# EAGLE design Keyboard_Scanner_2pp_RevA (EAGLE 9.6.2)
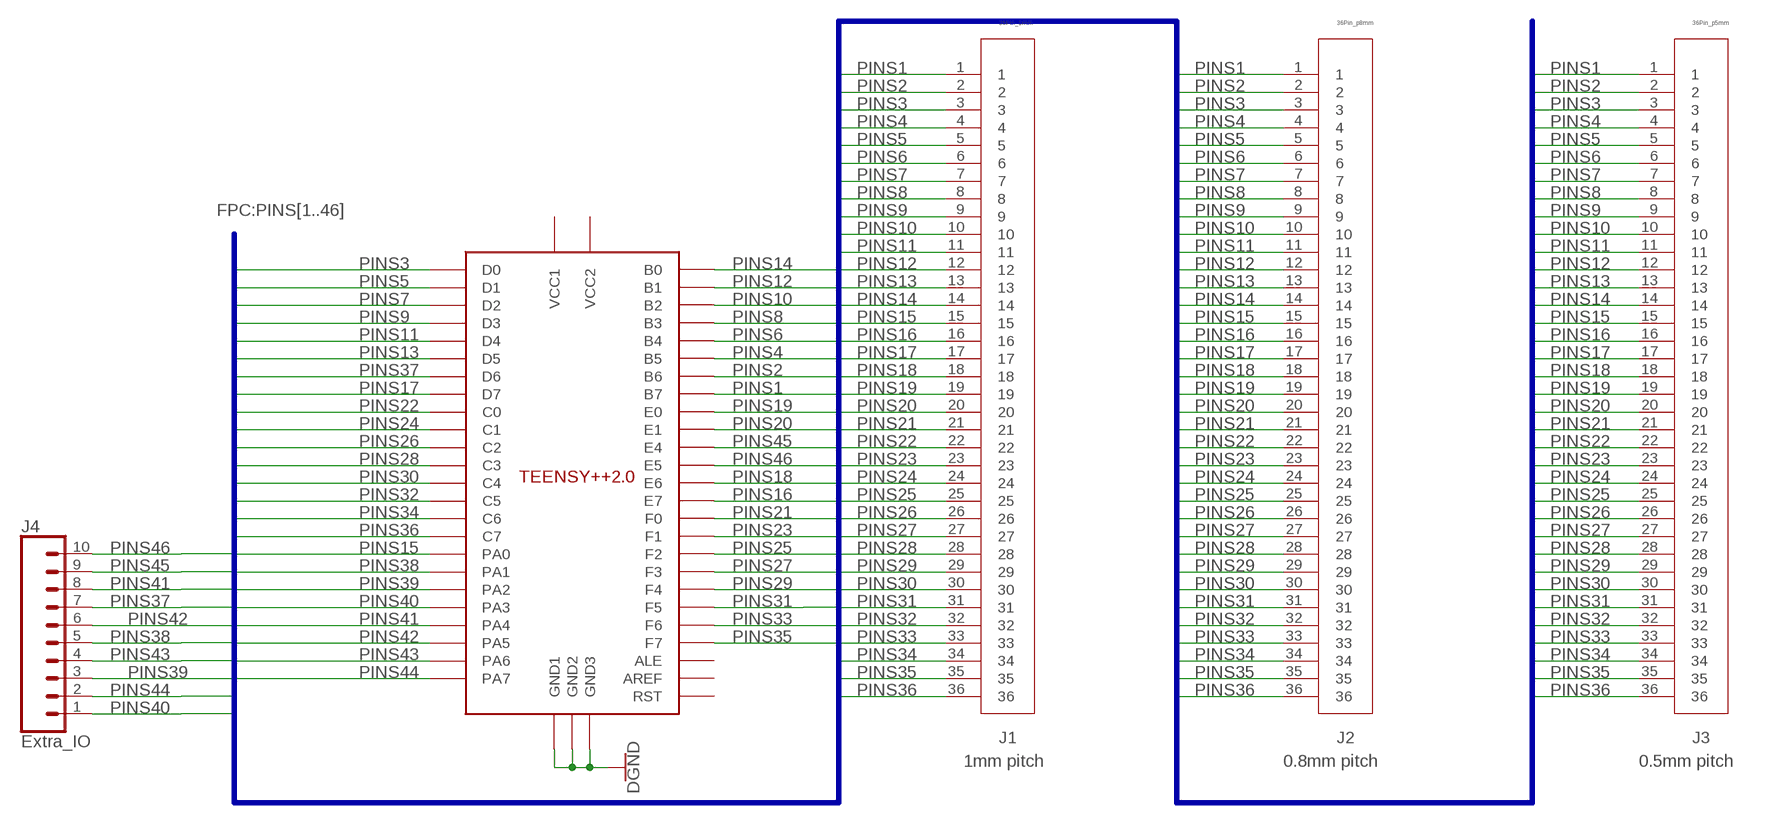
[diagram p0: schematic, sheet 1]

## Parts
J1  36Pin_1mm  FPC36_1MM  [FPC36_1MM]
J2  36Pin_p8mm  FPC36_P8MM  [FPC36_P8MM]
J3  36Pin_p5mm  FPC36_P5MM  [FPC36_P5MM]
J4  Extra_IO  CONN_10"  [1X10]
U$1  Teensy++2.0  TEENSYPP2.0  [TEENSYPP2.0]

## Nets
GND: U$1.GND1 U$1.GND2 U$1.GND3 ; supply symbol labelled DGND
PINS1: J1.1 J2.1 J3.1 U$1.B7
PINS2: J1.2 J2.2 J3.2 U$1.B6
PINS3: J1.3 J2.3 J3.3 U$1.D0
PINS4: J1.4 J2.4 J3.4 U$1.B5
PINS5: J1.5 J2.5 J3.5 U$1.D1
PINS6: J1.6 J2.6 J3.6 U$1.B4
PINS7: J1.7 J2.7 J3.7 U$1.D2
PINS8: J1.8 J2.8 J3.8 U$1.B3
PINS9: J1.9 J2.9 J3.9 U$1.D3
PINS10: J1.10 J2.10 J3.10 U$1.B2
PINS11: J1.11 J2.11 J3.11 U$1.D4
PINS12: J1.12 J2.12 J3.12 U$1.B1
PINS13: J1.13 J2.13 J3.13 U$1.D5
PINS14: J1.14 J2.14 J3.14 U$1.B0
PINS15: J1.15 J2.15 J3.15 U$1.PA0
PINS16: J1.16 J2.16 J3.16 U$1.E7
PINS17: J1.17 J2.17 J3.17 U$1.D7
PINS18: J1.18 J2.18 J3.18 U$1.E6
PINS19: J1.19 J2.19 J3.19 U$1.E0
PINS20: J1.20 J2.20 J3.20 U$1.E1
PINS21: J1.21 J2.21 J3.21 U$1.F0
PINS22: J1.22 J2.22 J3.22 U$1.C0
PINS23: J1.23 J2.23 J3.23 U$1.F1
PINS24: J1.24 J2.24 J3.24 U$1.C1
PINS25: J1.25 J2.25 J3.25 U$1.F2
PINS26: J1.26 J2.26 J3.26 U$1.C2
PINS27: J1.27 J2.27 J3.27 U$1.F3
PINS28: J1.28 J2.28 J3.28 U$1.C3
PINS29: J1.29 J2.29 J3.29 U$1.F4
PINS30: J1.30 J2.30 J3.30 U$1.C4
PINS31: J1.31 J2.31 J3.31 U$1.F5
PINS32: J1.32 J2.32 J3.32 U$1.C5
PINS33: J1.33 J2.33 J3.33 U$1.F6
PINS34: J1.34 J2.34 J3.34 U$1.C6
PINS35: J1.35 J2.35 J3.35 U$1.F7
PINS36: J1.36 J2.36 J3.36 U$1.C7
PINS37: J4.7 U$1.D6
PINS38: J4.5 U$1.PA1
PINS39: J4.3 U$1.PA2
PINS40: J4.1 U$1.PA3
PINS41: J4.8 U$1.PA4
PINS42: J4.6 U$1.PA5
PINS43: J4.4 U$1.PA6
PINS44: J4.2 U$1.PA7
PINS45: J4.9 U$1.E4
PINS46: J4.10 U$1.E5
Unconnected: U$1.ALE U$1.AREF U$1.RST U$1.VCC1 U$1.VCC2

## Buses
FPC:PINS[1..46]

## Notes on the sheet
- 1mm pitch | 0.8mm pitch | 0.5mm pitch

## Library data of the parts
J1 = FPC36_1mm:FPC36_1MM: Molex Right Angle FPC Connector 1mm pitch, bottom contacts with 32 pins. Molex Part Number DigiKey Part Number
J2 = FPC36_p8mm:FPC36_P8MM: Molex Right Angle FPC Connector 1mm pitch, bottom contacts with 32 pins. Molex Part Number DigiKey Part Number
J3 = FPC36_p5mm:FPC36_P5MM: Molex Right Angle FPC Connector 1mm pitch, bottom contacts with 32 pins. Molex Part Number DigiKey Part Number
J4 = SparkFun-Connectors:CONN_10: Multi connection point. Often used as Generic Header-pin footprint for 0.1 inch spaced/style header connections On any of the 0.1 inch spaced packages, you can populate with these: Break Away Headers - Straight <https://www.sparkfun.com/products/116> (PRT-00116) Break Away Male Headers - Right Angle <https://www.sparkfun.com/products/553> (PRT-00553) Female Headers <https://www.sparkfun.com/products/115> (PRT-00115) Break Away Headers - Machine Pin <https://www.sparkfun.com/products/117> (PRT-00117) Break Away Female Headers - Swiss Machine Pin <https://www.sparkfun.com/products/743> (PRT-00743) Arduino Stackable Header - 10 Pin <https://www.sparkfun.com/products/11376> (PRT-11376) For SCREWTERMINALS and SPRING TERMINALS visit here: Screw Terimnals on SparkFun.com <https://www.sparkfun.com/search/results?term=Screw+Terminals> (5mm/3.5mm/2.54mm spacing) This device is also useful as a general connection point to wire up your design to another part of your project. Our various solder wires solder well into these plated through hole pads. Hook-Up Wire - Assortment (Stranded, 22 AWG) <https://www.sparkfun.com/products/11375> (PRT-11375) Hook-Up Wire - Assortment (Solid Core, 22 AWG) <https://www.sparkfun.com/products/11367> (PRT-11367) View the entire wire category on our website here <https://www.sparkfun.com/categories/141> Special notes: Molex polarized connector foot print use with SKU : PRT-08231 with associated crimp pins and housings. 1MM SMD Version SKU: PRT-10208 NOTES ON THE VARIANTS LOCK and LOCK_LONGPADS... This footprint was designed to help hold the alignment of a through-hole component (i.e. 6-pin header) while soldering it into place. You may notice that each hole has been shifted either up or down by 0.005 of an inch from it's more standard position (which is a perfectly straight line). This slight alteration caused the pins (the squares in the middle) to touch the edges of the holes. Because they are alternating, it causes a "brace" to hold the component in place. 0.005 has proven to be the perfect amount of "off-center" position when using our standard breakaway headers. Although looks a little odd when you look at the bare footprint, once you have a header in there, the alteration is very hard to notice. Also,if you push a header all the way into place, it is covered up entirely on the bottom side.; PROD_ID: CONN-11563
U$1 = Teensy:TEENSYPP2.0

## Board
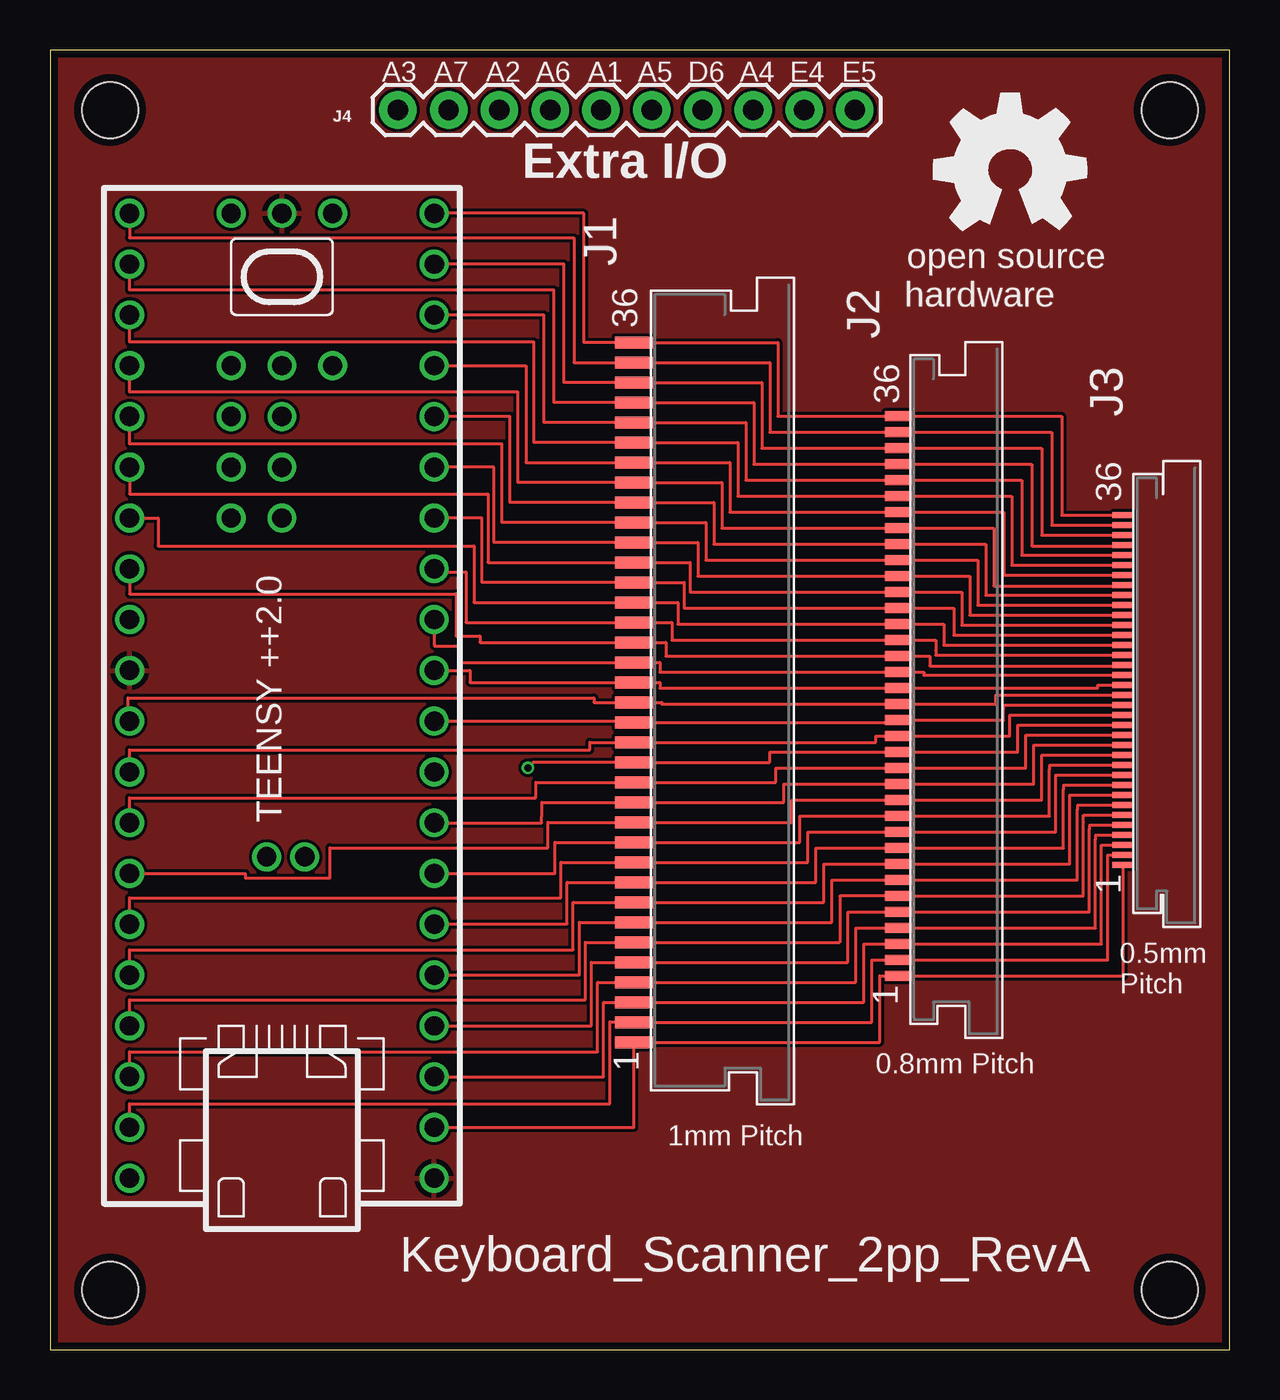
[diagram p1: board, top side]
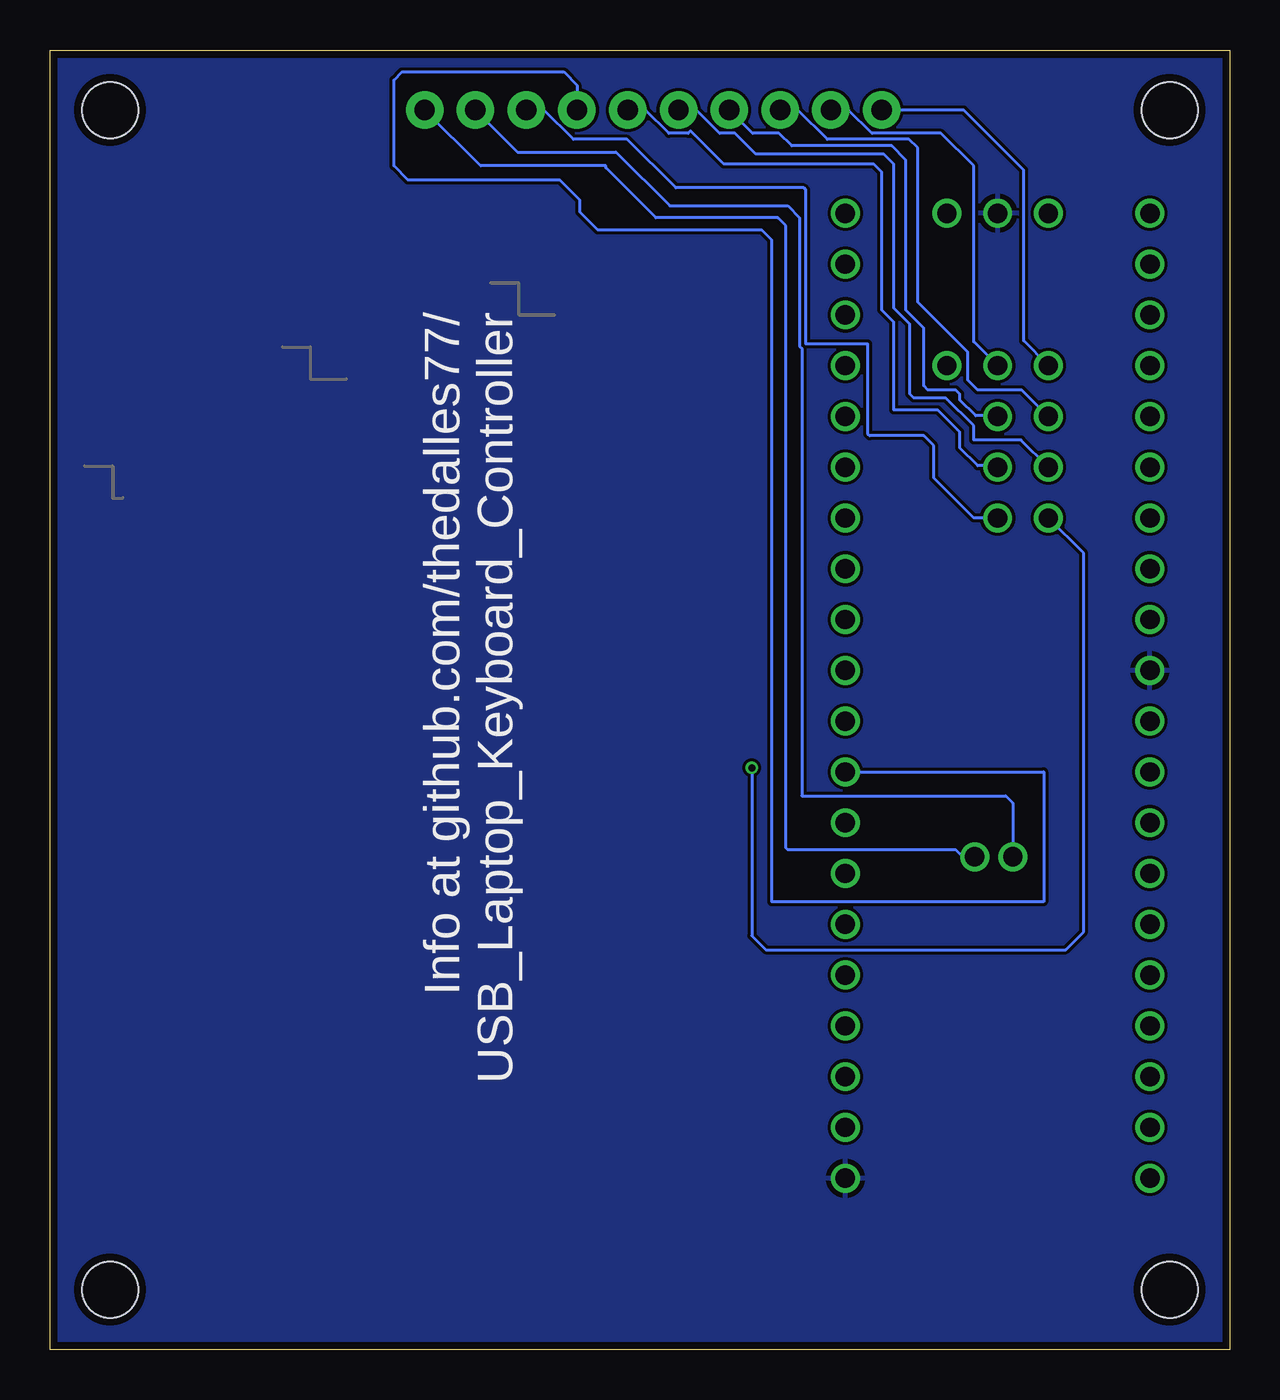
[diagram p2: board, bottom side, seen from below]

Size 59 x 65 mm. Coordinates in mm from the lower left corner, seen from the top.
Outline: 0,0 59,0 59,65 0,65 0,0
Copper layers (1*16): Top 0.035559375mm / dielectric 1.6mm / Bottom 0.035559375mm
Design rules "oshpark-2layer": minimum track width 6mil, minimum drill 10mil, track to track 6mil, track to pad 6mil, pad to pad 6mil, via to via 6mil, smd to smd 6mil, copper to edge 15mil, drill to drill 6mil, minimum pad ring 5mil, minimum via ring 5mil, stop-mask expansion 2.5mil, vias tented up to drill 0mil, thermal gap 10mil
Holes 2.8 mm at 3,3 3,62 56,62 56,3

### Footprints (pad centres in the part's own frame; a part is rotated, then mirrored left to right if it is on the bottom)
FPC36_1MM = smd 0.6 x 1.9: 1 -13.7,3.86; 2 -12.7,3.86; 3 -11.7,3.86; 4 -10.7,3.86; 5 -9.7,3.86; 6 -8.7,3.86; 7 -7.7,3.86; 8 -6.7,3.86; 9 -5.7,3.86; 10 -4.7,3.86; 11 -3.7,3.86; 12 -2.7,3.86; 13 -1.7,3.86; 14 -0.7,3.86; 15 0.3,3.86; 16 1.3,3.86; 17 2.3,3.86; 18 3.3,3.86; 19 4.3,3.86; 20 5.3,3.86; 21 6.3,3.86; 22 7.3,3.86; 23 8.3,3.86; 24 9.3,3.86; 25 10.3,3.86; 26 11.3,3.86; 27 12.3,3.86; 28 13.3,3.86; 29 14.3,3.86; 30 15.3,3.86; 31 16.3,3.86; 32 17.3,3.86; 33 18.3,3.86; 34 19.3,3.86; 35 20.3,3.86; 36 21.3,3.86
FPC36_P8MM = smd 0.5 x 1.35: 1 -13.7,3.6; 2 -12.9,3.6; 3 -12.1,3.6; 4 -11.3,3.6; 5 -10.5,3.6; 6 -9.7,3.6; 7 -8.9,3.6; 8 -8.1,3.6; 9 -7.3,3.6; 10 -6.5,3.6; 11 -5.7,3.6; 12 -4.9,3.6; 13 -4.1,3.6; 14 -3.3,3.6; 15 -2.5,3.6; 16 -1.7,3.6; 17 -0.9,3.6; 18 -0.1,3.6; 19 0.7,3.6; 20 1.5,3.6; 21 2.3,3.6; 22 3.1,3.6; 23 3.9,3.6; 24 4.7,3.6; 25 5.5,3.6; 26 6.3,3.6; 27 7.1,3.6; 28 7.9,3.6; 29 8.7,3.6; 30 9.5,3.6; 31 10.3,3.6; 32 11.1,3.6; 33 11.9,3.6; 34 12.7,3.6; 35 13.5,3.6; 36 14.3,3.6
FPC36_P5MM = smd 0.3 x 1.1: 1 -13.7,3.5; 2 -13.2,3.5; 3 -12.7,3.5; 4 -12.2,3.5; 5 -11.7,3.5; 6 -11.2,3.5; 7 -10.7,3.5; 8 -10.2,3.5; 9 -9.7,3.5; 10 -9.2,3.5; 11 -8.7,3.5; 12 -8.2,3.5; 13 -7.7,3.5; 14 -7.2,3.5; 15 -6.7,3.5; 16 -6.2,3.5; 17 -5.7,3.5; 18 -5.2,3.5; 19 -4.7,3.5; 20 -4.2,3.5; 21 -3.7,3.5; 22 -3.2,3.5; 23 -2.7,3.5; 24 -2.2,3.5; 25 -1.7,3.5; 26 -1.2,3.5; 27 -0.7,3.5; 28 -0.2,3.5; 29 0.3,3.5; 30 0.8,3.5; 31 1.3,3.5; 32 1.8,3.5; 33 2.3,3.5; 34 2.8,3.5; 35 3.3,3.5; 36 3.8,3.5
1X10 = drill 1.016 pad 1.88: 1 0,0; 2 2.54,0; 3 5.08,0; 4 7.62,0; 5 10.16,0; 6 12.7,0; 7 15.24,0; 8 17.78,0; 9 20.32,0; 10 22.86,0
TEENSYPP2.0 = drill 0.965: ALE 16.51,-2.54; AREF 3.81,7.62; B0 -6.35,7.62; B1 -8.89,7.62; B2 -11.43,7.62; B3 -13.97,7.62; B4 -16.51,7.62; B5 -19.05,7.62; B6 -21.59,7.62; B7 -21.59,-7.62; C0 6.35,-7.62; C1 8.89,-7.62; C2 11.43,-7.62; C3 13.97,-7.62; C4 16.51,-7.62; C5 19.05,-7.62; C6 21.59,-7.62; C7 24.13,-7.62; D0 -19.05,-7.62; D1 -16.51,-7.62; D2 -13.97,-7.62; D3 -11.43,-7.62; D4 -8.89,-7.62; D5 -6.35,-7.62; D6 -3.81,-7.62; D7 -1.27,-7.62; E0 1.27,-7.62; E1 3.81,-7.62; E4 -8.052,0.762; E5 -8.052,-1.143; E6 -1.27,7.62; E7 -3.81,7.62; F0 6.35,7.62; F1 8.89,7.62; F2 11.43,7.62; F3 13.97,7.62; F4 16.51,7.62; F5 19.05,7.62; F6 21.59,7.62; F7 24.13,7.62; GND1 -24.13,-7.62; GND2 24.13,0; GND3 1.27,7.62; PA0 8.89,2.54; PA1 11.43,2.54; PA2 13.97,2.54; PA3 16.51,2.54; PA4 8.89,0; PA5 11.43,0; PA6 13.97,0; PA7 16.51,0; RST 24.13,2.54; VCC1 -24.13,7.62; VCC2 24.13,-2.54

### Placement (x,y rotation side)
J1  33.07,29.07 90 top
J2  46.03,32.38 90 top
J3  57.19,37.93 90 top
J4  17.4,62 0 top
U$1  11.6,32.7 90 top
U$2  [OSHW_8MM]  48,59 0 top

### Tracks (layer width: path | path; a pad name or v marks a point on that pad's centre or on a via)
GND
  pour Top: 0,0 0,65 59,65 59,0
  pour Bottom: 0,0 0,65 59,65 59,0
PINS1
  Top 0.152: U$1.B7 29.21,11.11 J1.1 41.5,15.37 41.5,18.7 42.43,18.7 J2.1 53.69,18.68 J3.1
PINS2
  Top 0.152: U$1.B6 3.98,12.3 28,12.3 28,16.4 29.21,16.4 J1.2 41.1,16.37 41.1,19.48 J2.2 52.9,19.48 52.9,24.73 J3.2
PINS3
  Top 0.152: U$1.D0 27.7,13.65 27.7,17.37 J1.3 40.7,17.37 40.7,20.28 J2.3 52.59,20.28 52.59,25.23 J3.3
PINS4
  Top 0.152: U$1.B5 3.98,14.9 27.39,14.9 27.39,18.37 J1.4 40.3,18.37 40.3,21.08 J2.4 52.29,21.08 52.29,25.54 52.3,25.54 52.3,25.73 J3.4
PINS5
  Top 0.152: U$1.D1 27.09,16.19 27.09,19.37 J1.5 39.9,19.37 39.9,21.88 J2.5 51.99,21.88 51.99,26.04 52,26.04 52,26.23 J3.5
PINS6
  Top 0.152: U$1.B4 3.98,17.5 26.78,17.5 26.78,20.37 J1.6 39.5,20.37 39.5,22.68 J2.6 51.68,22.68 51.68,26.34 51.7,26.34 51.7,26.73 J3.6
PINS7
  Top 0.152: U$1.D2 26.48,18.73 26.48,21.37 J1.7 39.1,21.37 39.1,23.48 J2.7 51.38,23.48 51.38,27.04 51.4,27.04 51.4,27.23 J3.7
PINS8
  Top 0.152: U$1.B3 3.98,20 26.17,20 26.17,22.37 J1.8 38.7,22.37 38.7,24.28 J2.8 51,24.28 51,27.73 J3.8
PINS9
  Top 0.152: U$1.D3 19.22,21.3 25.87,21.3 25.87,23.37 J1.9 38.3,23.37 38.3,25.08 J2.9 50.7,25.08 50.7,28.04 50.7,28.23 J3.9
PINS10
  Top 0.152: U$1.B2 3.98,22.6 25.56,22.6 25.56,24.37 J1.10 37.9,24.37 37.9,25.88 J2.10 50.3,25.88 50.3,28.73 J3.10
PINS11
  Top 0.152: U$1.D4 25.26,23.81 25.26,25.37 J1.11 37.5,25.37 37.5,26.68 J2.11 49.99,26.68 49.99,29.04 50,29.04 50,29.23 J3.11
PINS12
  Top 0.152: U$1.B1 9.77,23.81 9.77,23.58 14,23.58 14,25.1 24.9,25.1 24.9,26.37 J1.12 37.1,26.37 37.1,27.48 J2.12 49.6,27.48 49.6,29.73 J3.12
PINS13
  Top 0.152: U$1.D5 24.59,26.35 24.59,26.68 24.6,26.68 24.6,27.37 J1.13 36.7,27.37 36.7,28.28 J2.13 49.2,28.28 49.2,30.23 J3.13
PINS14
  Top 0.152: U$1.B0 3.98,27.6 24.3,27.6 24.3,27.68 24.3,28.37 J1.14 36.3,28.37 36.3,29.08 J2.14 48.8,29.08 48.8,30.73 J3.14
PINS15  (via drill 0.35)
  Top 0.152: J3.15 48.4,31.23 48.4,29.88 J2.15 36,29.88 36,29.39 35.99,29.39 35.99,29.37 J1.15 24.17,29.37 v23.9,29.1
  Bottom 0.152: v23.9,29.1 23.9,20.7 23.2,20 8.2,20 7.3,20.9 7.3,39.83 U$1.PA0
PINS16
  Top 0.152: U$1.E7 3.98,30 27,30 27,30.37 J1.16 41.3,30.37 41.3,30.68 J2.16 48,30.68 48,31.73 J3.16
PINS17
  Top 0.152: U$1.D7 29.21,31.43 J1.17 42.43,31.37 J2.17 47.7,31.48 47.7,32.03 47.7,32.23 J3.17
PINS18
  Top 0.152: U$1.E6 3.9,31.43 3.9,32.6 27.2,32.6 27.2,32.37 J1.18 30.6,32.37 30.6,32.28 J2.18 47.3,32.28 47.3,32.73 J3.18
PINS19
  Top 0.152: U$1.E0 21,33.97 21,33.37 J1.19 30.5,33.37 30.5,33.08 J2.19 52.4,33.08 52.4,33.23 J3.19
PINS20
  Top 0.152: U$1.E1 19.22,35.2 20.5,35.2 20.5,34.37 J1.20 30.5,34.37 30.5,33.88 J2.20 43.7,33.88 43.7,33.73 J3.20
PINS21
  Top 0.152: U$1.F0 3.98,37.8 20.3,37.8 20.3,35.7 21.5,35.7 21.5,35.37 J1.21 30.8,35.37 30.8,34.68 J2.21 44,34.68 44,34.2 53.69,34.2 J3.21
PINS22
  Top 0.152: U$1.C0 19.22,38.9 20.8,38.9 20.8,36.37 J1.22 31.11,36.37 31.11,35.48 J2.22 44.3,35.48 44.3,34.98 44.3,34.73 J3.22
PINS23
  Top 0.152: U$1.F1 5.4,41.59 5.4,40.2 21.2,40.2 21.2,37.37 J1.23 31.41,37.37 31.41,36.28 J2.23 44.7,36.28 44.7,35.23 J3.23
PINS24
  Top 0.152: U$1.C1 21.6,41.59 21.6,38.37 J1.24 31.71,38.37 31.71,37.08 J2.24 45.2,37.08 45.2,35.73 J3.24
PINS25
  Top 0.152: U$1.F2 3.98,42.8 21.91,42.8 21.91,39.37 J1.25 32.02,39.37 32.02,37.88 J2.25 45.6,37.88 45.6,36.23 J3.25
PINS26
  Top 0.152: U$1.C2 22.2,44.13 22.2,43.1 22.21,43.1 22.21,40.37 J1.26 32.4,40.37 32.4,38.68 J2.26 46,38.68 46,36.73 J3.26
PINS27
  Top 0.152: U$1.F3 3.98,45.3 22.6,45.3 22.6,41.37 J1.27 32.8,41.37 32.8,39.48 J2.27 46.4,39.48 46.4,37.23 J3.27
PINS28
  Top 0.152: U$1.C3 23,46.67 23,42.37 J1.28 33.2,42.37 33.2,40.28 J2.28 46.8,40.28 46.8,37.73 J3.28
PINS29
  Top 0.152: U$1.F4 3.98,47.9 23.4,47.9 23.4,43.37 J1.29 33.6,43.37 33.6,41.08 J2.29 47.2,41.08 47.2,38.2 53.69,38.2 J3.29
PINS30
  Top 0.152: U$1.C4 23.8,49.21 23.8,44.37 J1.30 34,44.37 34,41.88 J2.30 47.7,41.88 47.7,38.73 J3.30
PINS31
  Top 0.152: U$1.F5 3.98,50.4 24.2,50.4 24.2,45.37 J1.31 34.4,45.37 34.4,42.68 J2.31 48.1,42.68 48.1,39.23 J3.31
PINS32
  Top 0.152: U$1.C5 24.7,51.75 24.7,46.37 J1.32 34.8,46.37 34.8,43.48 J2.32 48.6,43.48 48.6,39.73 J3.32
PINS33
  Top 0.152: U$1.F6 3.98,53 25.2,53 25.2,47.37 J1.33 35.2,47.37 35.2,44.28 J2.33 49.1,44.28 49.1,40.2 53.69,40.2 J3.33
PINS34
  Top 0.152: U$1.C6 25.7,54.29 25.7,48.37 J1.34 35.6,48.37 35.6,45.08 J2.34 49.6,45.08 49.6,40.73 J3.34
PINS35
  Top 0.152: U$1.F7 3.98,55.6 26.2,55.6 26.2,49.37 J1.35 36,49.37 36,45.88 J2.35 50.1,45.88 50.1,41.23 J3.35
PINS36
  Top 0.152: U$1.C7 26.7,56.83 26.7,50.37 J1.36 36.4,50.37 36.4,46.68 J2.36 50.6,46.68 50.6,41.73 J3.36
PINS37
  Bottom 0.152: U$1.D6 9.3,28.89 9.3,22.4 22.9,22.4 22.9,55.5 23.4,56 31.6,56 32.5,56.9 32.5,57.5 33.5,58.5 41.1,58.5 41.8,59.2 41.8,63.5 41.39,63.91 33.3,63.91 32.64,63.25 J4.7
PINS38
  Bottom 0.152: U$1.PA1 10.43,45.5 12.8,45.5 12.8,46.2 14.2,47.6 15.8,47.6 16,47.8 16,51.3 16.8,52.1 16.8,59.3 17.3,59.8 23.7,59.8 24.73,60.83 25.5,60.83 26.67,62 J4.5
PINS39
  Bottom 0.152: U$1.PA2 10.39,48 12.6,48 13.1,48.5 13.1,49.9 15.6,52.4 15.6,60.1 16.03,60.53 20.12,60.53 21.59,62 J4.3
PINS40
  Bottom 0.152: U$1.PA3 10.3,50.45 10.3,59 13.3,62 J4.1
PINS41
  Bottom 0.152: U$1.PA4 12.79,41.59 14.8,43.6 14.8,45.2 15.3,45.7 18,45.7 18.1,45.8 18.1,50.3 21.2,50.3 21.2,58 21.3,58.1 27.7,58.1 30.13,60.53 32.82,60.53 34.29,62 J4.8
PINS42
  Bottom 0.152: U$1.PA5 11.67,44.2 12.6,44.2 13.5,45.1 13.5,45.9 14.6,47 16.8,47 16.8,51.4 17.4,52 17.4,58.9 17.8,59.3 25.3,59.3 26.95,60.95 27.08,60.83 28.04,60.83 29.21,62 J4.6
PINS43
  Bottom 0.152: U$1.PA6 11.63,46.7 12.7,46.7 13.5,47.5 13.5,47.8 13.7,48 15.1,48 15.3,48.2 15.3,51.1 16.2,52 16.2,59.5 16.9,60.2 21.9,60.2 22.53,60.83 23.85,60.83 J4.4
PINS44
  Bottom 0.152: U$1.PA7 12.8,50.41 12.8,59.2 14.43,60.83 17.88,60.83 19.05,62 J4.2
PINS45
  Bottom 0.152: J4.9 35.62,59.9 30.7,59.9 28,57.2 22.1,57.2 21.5,56.6 21.5,50.17 21.4,50.07 21.4,27.7 11.2,27.7 10.84,27.34 U$1.E4
PINS46
  Bottom 0.152: U$1.E5 13.35,24.65 13.7,25 22.1,25 22.2,25.1 22.2,56.2 22.6,56.6 28.7,56.6 31.2,59.1 31.2,59.2 37.46,59.2 J4.10

### Text on the board
tPlace: A3 | A7 | A2 | A6 | A1 | A5 | D6 | A4 | E4 | E5 | Extra I/O | 36 | 36 | 36 | 0.5mm / Pitch | 0.8mm Pitch | 1mm Pitch | Keyboard_Scanner_2pp_RevA
bPlace: Info at github.com/thedalles77/ / USB_Laptop_Keyboard_Controller